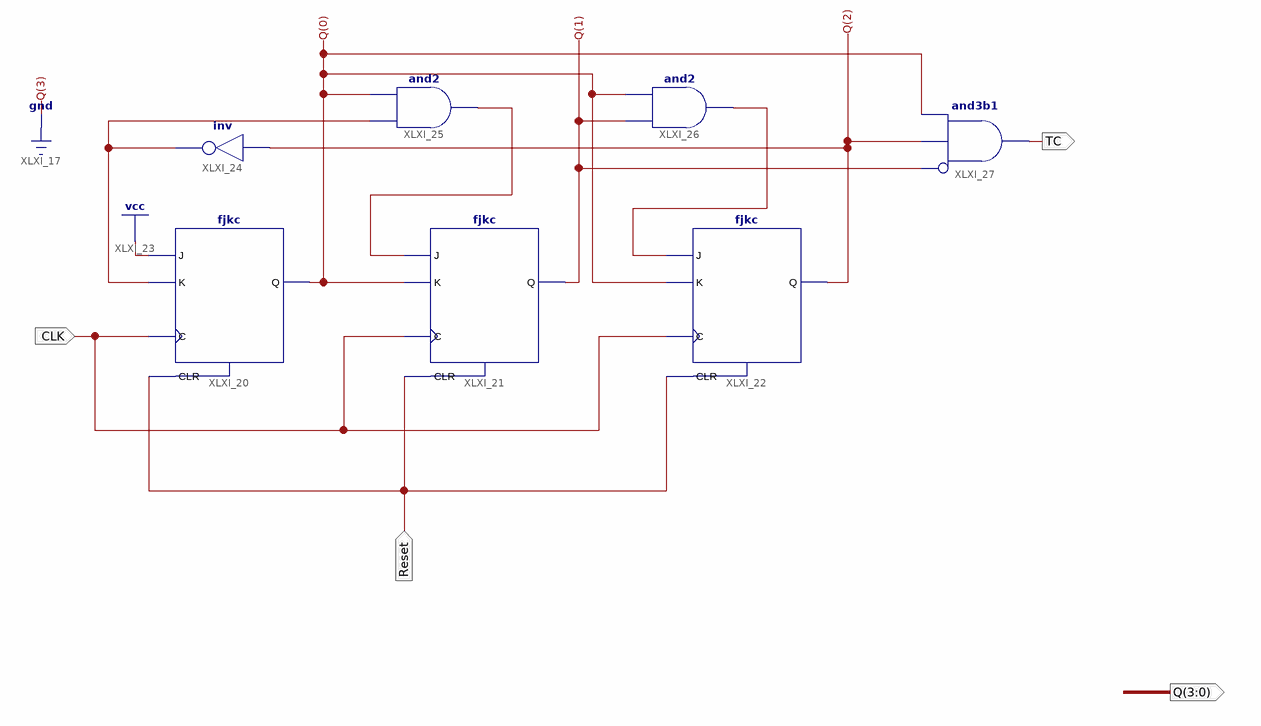
[diagram p0: schematic sheet 1]
// Xilinx ISE schematic Counter1_5.sch (spartan6) as structural Verilog: 7 symbols, 4 ports
module Counter1_5 (
  input  CLK,
  input  Reset,
  output [3:0] Q,
  output TC
);

  wire XLXN_41, XLXN_42, XLXN_44;

  fjkc XLXI_20 (.C(CLK), .CLR(Reset), .J(1'b1), .K(XLXN_41), .Q(Q[0]));
  fjkc XLXI_21 (.C(CLK), .CLR(Reset), .J(XLXN_42), .K(Q[0]), .Q(Q[1]));
  fjkc XLXI_22 (.C(CLK), .CLR(Reset), .J(XLXN_44), .K(Q[0]), .Q(Q[2]));
  not XLXI_24 (XLXN_41, Q[2]);
  and XLXI_25 (XLXN_42, XLXN_41, Q[0]);
  and XLXI_26 (XLXN_44, Q[1], Q[0]);
  and XLXI_27 (TC, ~Q[1], Q[2], Q[0]);  // and3b1

  assign Q[3] = 1'b0;
endmodule
